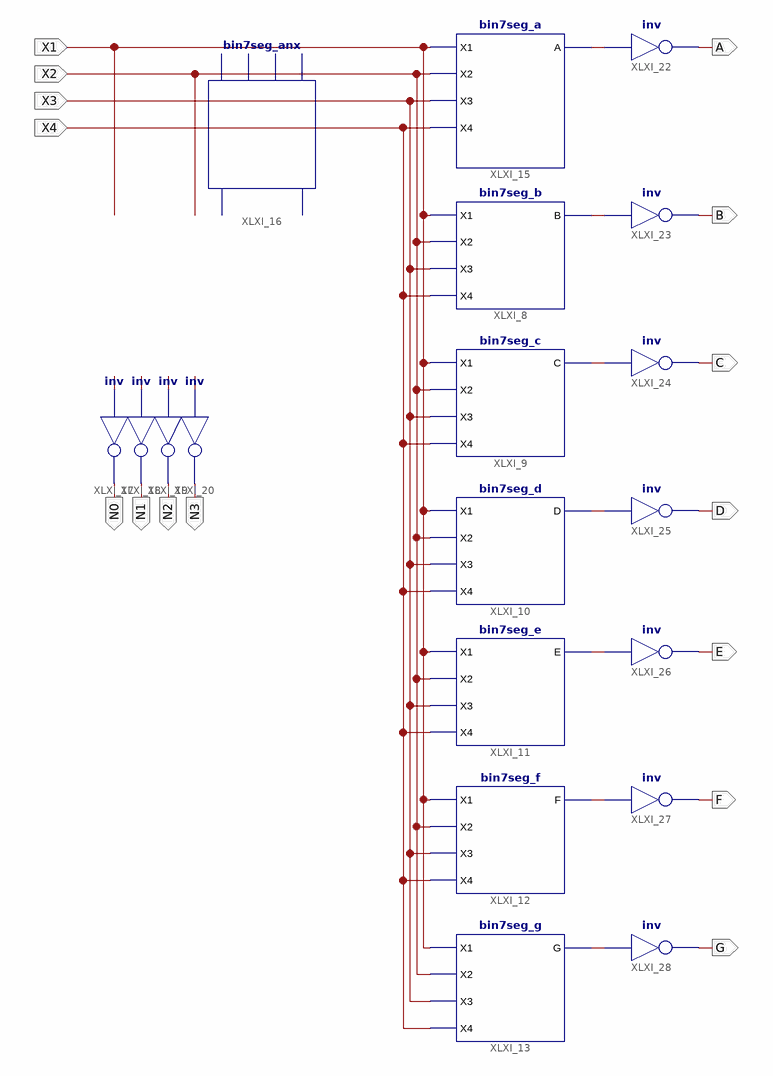
[diagram p0: schematic sheet 1]
// Xilinx ISE schematic bin7seg.sch (spartan3e) as structural Verilog: 19 symbols, 15 ports
module bin7seg (
  input  X1,
  input  X2,
  input  X3,
  input  X4,
  output N0,
  output N1,
  output N2,
  output N3,
  output B,
  output C,
  output D,
  output E,
  output F,
  output G,
  output A
);

  wire XLXN_34, XLXN_35, XLXN_36, XLXN_37, XLXN_42, XLXN_43, XLXN_44, XLXN_45, XLXN_46, XLXN_47, XLXN_48;

  bin7seg_c XLXI_9 (.X1(X1), .X2(X2), .X3(X3), .X4(X4), .C(XLXN_44));
  bin7seg_d XLXI_10 (.X1(X1), .X2(X2), .X3(X3), .X4(X4), .D(XLXN_45));
  bin7seg_e XLXI_11 (.X1(X1), .X2(X2), .X3(X3), .X4(X4), .E(XLXN_46));
  bin7seg_f XLXI_12 (.X1(X1), .X2(X2), .X3(X3), .X4(X4), .F(XLXN_47));
  bin7seg_g XLXI_13 (.X1(X1), .X2(X2), .X3(X3), .X4(X4), .G(XLXN_48));
  bin7seg_b XLXI_8 (.X1(X1), .X2(X2), .X3(X3), .X4(X4), .B(XLXN_43));
  bin7seg_a XLXI_15 (.X1(X1), .X2(X2), .X3(X3), .X4(X4), .A(XLXN_42));
  bin7seg_anx XLXI_16 (.X1(X1), .X2(X2), .N0(XLXN_34), .N1(XLXN_35), .N2(XLXN_36), .N3(XLXN_37));
  not XLXI_17 (N0, XLXN_34);
  not XLXI_18 (N1, XLXN_35);
  not XLXI_19 (N2, XLXN_36);
  not XLXI_20 (N3, XLXN_37);
  not XLXI_23 (B, XLXN_43);
  not XLXI_24 (C, XLXN_44);
  not XLXI_25 (D, XLXN_45);
  not XLXI_26 (E, XLXN_46);
  not XLXI_27 (F, XLXN_47);
  not XLXI_28 (G, XLXN_48);
  not XLXI_22 (A, XLXN_42);
endmodule
